# EasyEDA Pro project 606-Hihat-Generator.eprj

# Board PCB1
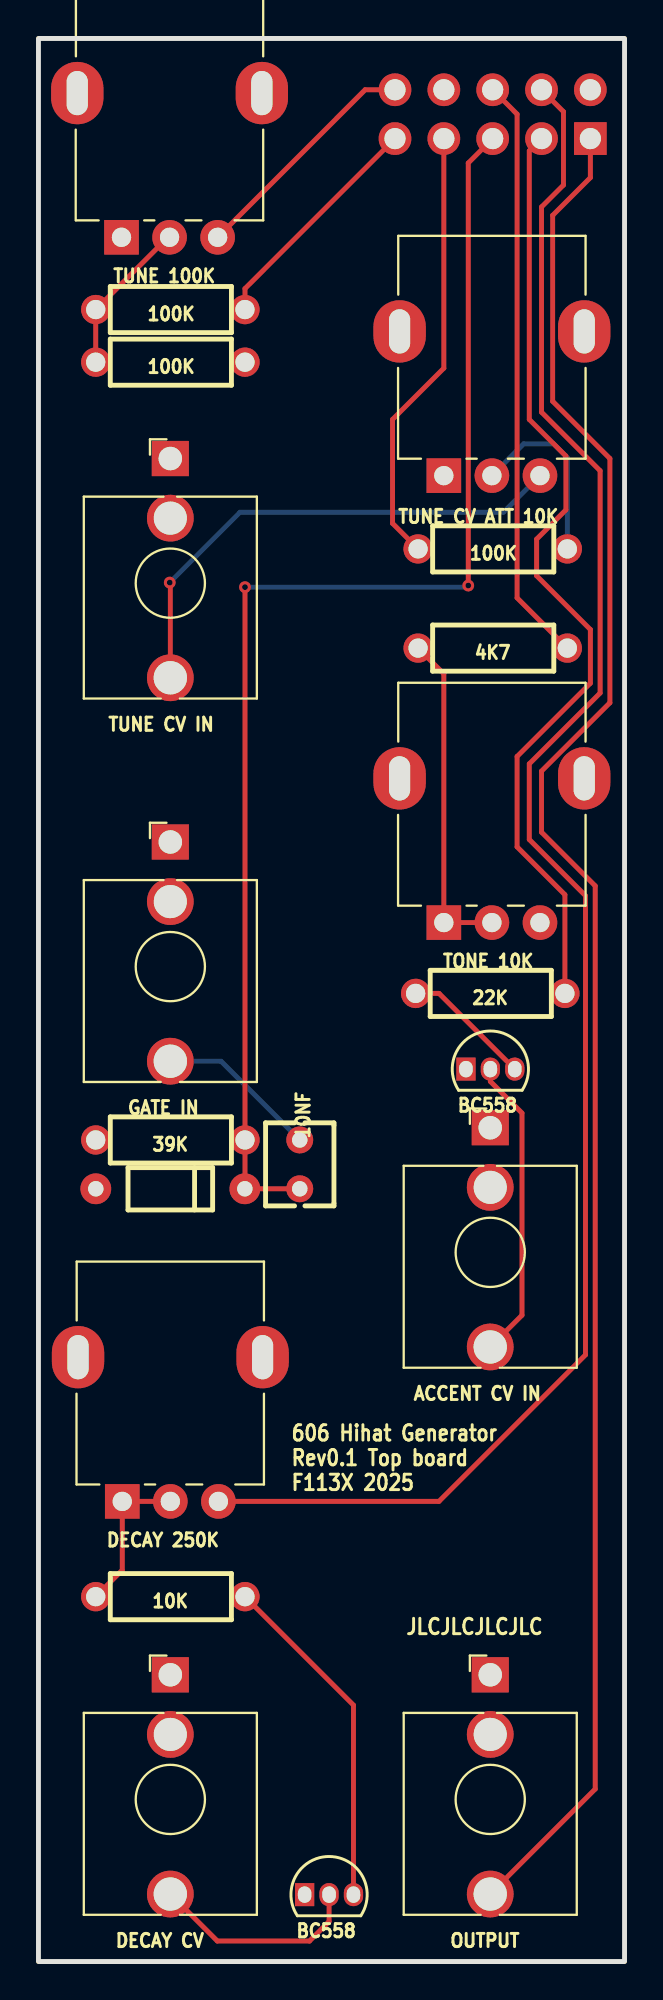
[diagram p0: board, top side]
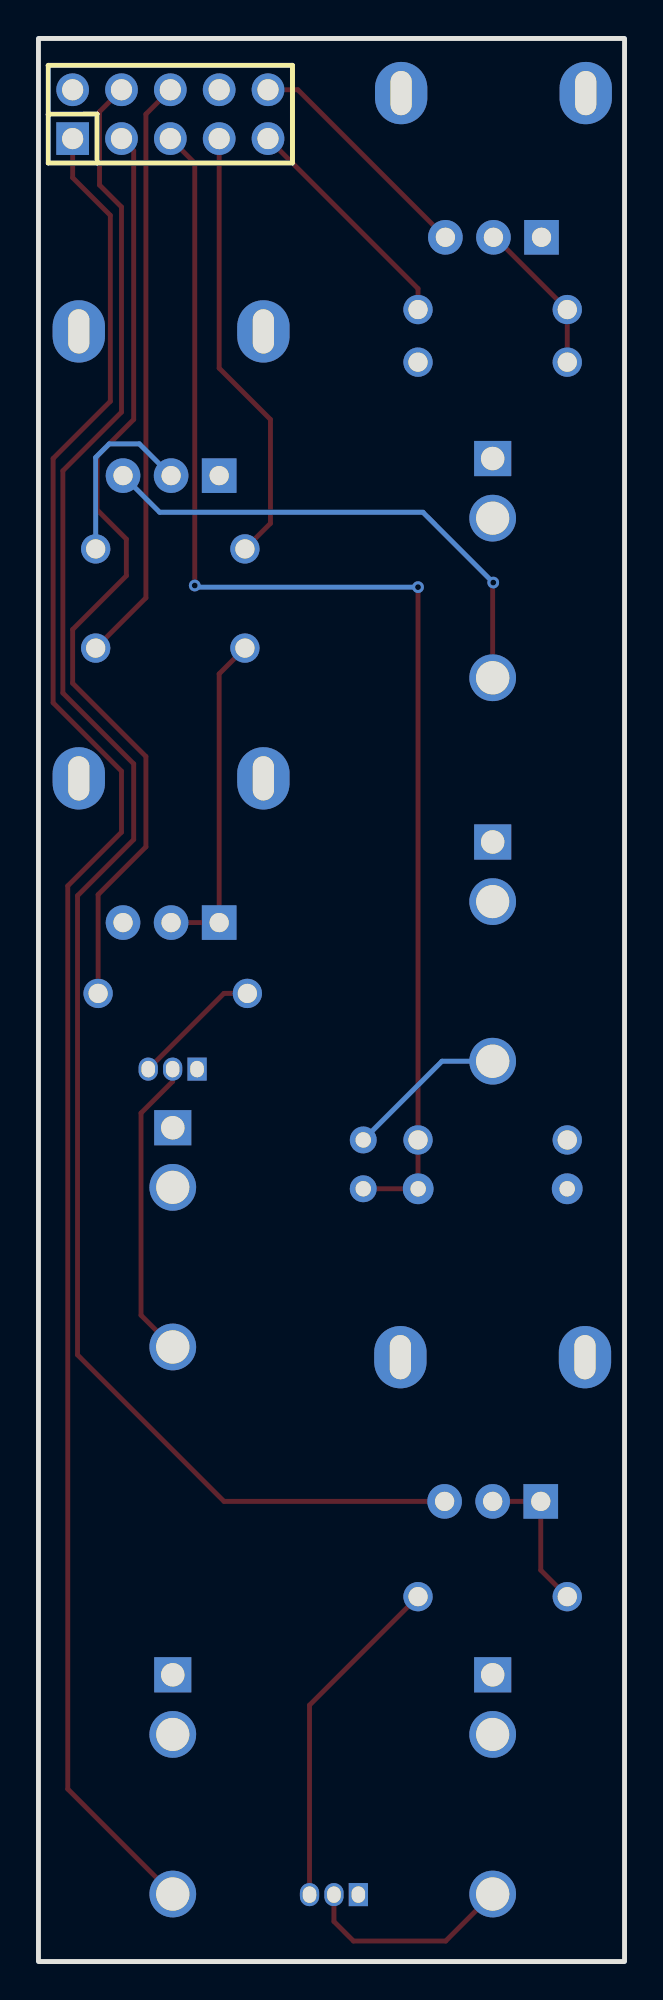
[diagram p1: board, bottom side, seen from below]

Outline 30.48 x 100 mm; copper layers: Top Layer, Bottom Layer. Coordinates in mm from the lower left corner of the outline.
Outline path: rectangle 0,100 30.48,0
Stack: Top Layer 0.035mm / Dielectric1 1.51mm FR4 er 4.5 / Bottom Layer 0.035mm

## Design rules (mm)
template: JLCPCB Capability(Two Layers Board)
spacing copperThickness1oz (default): track to track 0.102, other pairs 0.152 to 0.3
spacing copperThickness2oz: track to track 0.203, other pairs 0.152 to 0.3
track width copperThickness1oz (default): min 0.127, default 0.254, max 2.54
track width copperThickness2oz: min 0.203, default 0.254, max 2.54
differential pair differentialPair (default): width min 0.127, default 0.254, max 2.54; gap min 0.152, default 0.152
via viaSize (default): diameter min 0.5, default 0.61, max 10; hole min 0.3, default 0.305, max 6.3

## Placement (name value [footprint] x y rotation side)
4K7  -  [Resistor_Small]  23.62 68.3 0 top
10K  -  [Resistor_Small]  6.86 18.97 0 top
10NF  100nF  [CAP-TH_L4.2-W3.5-P2.54-D0.5]  13.59 41.45 270 top
22K  -  [Resistor_Small]  23.5 50.34 0 top
39K  -  [Resistor_Small]  6.86 42.72 0 top
100K  -  [Resistor_Small]  6.86 83.17 0 top
100K#2  -  [Resistor_Small]  6.86 85.9 0 top
100K#3  -  [Resistor_Small]  23.62 73.46 0 top
ACCENT CV IN  -  [benjiaomodular:AudioJack_3.5mm]  23.5 43.36 0 top
BC558  -  [TO-92-3_L4.5-W3.5-P1.27-L]  23.5 46.41 0 top
BC558#2  -  [TO-92-3_L4.5-W3.5-P1.27-L]  15.11 3.48 0 top
D1  1N4148  [DO-35_BD2.0-L4.2-P8.20-D0.5-RD]  6.86 40.18 180 top
DECAY 250K  -  [benjiaomodular:Potentiometer_RV09]  4.36 23.93 90 top
DECAY CV  -  [benjiaomodular:AudioJack_3.5mm]  6.86 14.91 0 top
GATE IN  -  [benjiaomodular:AudioJack_3.5mm]  6.86 58.22 0 top
OUTPUT  -  [benjiaomodular:AudioJack_3.5mm]  23.5 14.91 0 top
TONE 10K  -  [benjiaomodular:Potentiometer_RV09]  21.08 54.03 90 top
TUNE 100K  -  [benjiaomodular:Potentiometer_RV09]  4.32 89.66 90 top
TUNE CV ATT 10K  -  [benjiaomodular:Potentiometer_RV09]  21.08 77.27 90 top
TUNE CV IN  -  [benjiaomodular:AudioJack_3.5mm]  6.86 78.16 0 top
U1  ZX-PZ2.54-2-5PZZ  [HDR-TH_10P-P2.54-V-M-R2-C5-S2.54]  23.62 96.06 180 bottom

## Footprints (pads in the part's own frame, mm; a bottom-side part is the same pattern mirrored in y, then rotated)
benjiaomodular:AudioJack_3.5mm
  rect 1.93x1.83 hole 1.22: S(0,0)
  round 2.43 hole 1.73: T(0,-11.4)
  round 2.43 hole 1.72: TN(0,-3.1)
benjiaomodular:Potentiometer_RV09
  rect 1.8x1.8 hole 1: 1(0,0)
  round 1.8 hole 1: 2(0,-2.5) 3(0,-5)
  oval 3.24x2.72 hole 2.3x1.1: 4(7.5,-7.3) 5(7.5,2.3)
CAP-TH_L4.2-W3.5-P2.54-D0.5
  round 1.4 hole 0.8: 1(-1.27,0) 2(1.27,0)
DO-35_BD2.0-L4.2-P8.20-D0.5-RD
  round 1.6 hole 0.8: 1(-3.876,0) 2(3.876,0)
HDR-TH_10P-P2.54-V-M-R2-C5-S2.54
  rect 1.7x1.7 hole 1.1: 1(-5.08,-1.27)
  round 1.7 hole 1.1: 2(-5.08,1.27) 3(-2.54,-1.27) 4(-2.54,1.27) 5(0,-1.27) 6(0,1.27) 7(2.54,-1.27) 8(2.54,1.27) 9(5.08,-1.27) 10(5.08,1.27)
Resistor_Small
  round 1.524 hole 1: 1(-3.88,0) 2(3.882,0)
TO-92-3_L4.5-W3.5-P1.27-L
  rect 1x1.2 hole 0.7x0.85: 1(-1.27,0)
  oval 1x1.2 hole 0.7x0.85: 2(0,0) 3(1.27,0)

## Nets
GND: 39K.1 100K.2 ACCENT CV IN.S BC558.1 BC558#2.1 D1.2 DECAY CV.S GATE IN.S OUTPUT.S TONE 10K.3 TUNE 100K.1 TUNE CV ATT 10K.1 TUNE CV IN.S U1.2 U1.8
+12: TUNE 100K.3 U1.10
ACC-BACK: 22K.2 U1.3
ACC-RES: 22K.1 BC558.3
ACCENT CV: ACCENT CV IN.T BC558.2
CUTOFF FREQ: 4K7.1 TONE 10K.1 TONE 10K.2
CUTOFF-RES: 4K7.2 U1.6
CV IN: TUNE CV ATT 10K.3 TUNE CV IN.T
DECAY: DECAY 250K.3 U1.4
DECAY CV: BC558#2.2 DECAY CV.T
DECAY-MID: 10K.1 DECAY 250K.1 DECAY 250K.2
GATE IN: 10NF.1 GATE IN.T
GATE+: 10NF.2 39K.2 D1.1 U1.5
OUT: OUTPUT.T U1.1
PRE-DECAY-RES: 10K.2 BC558#2.3
TUNE CV MID: 100K#3.2 TUNE CV ATT 10K.2
TUNE MID: 100K.1 100K#2.1 TUNE 100K.2
TUNE+: 100K#2.2 U1.9
TUNE-: 100K#3.1 U1.7

Pads without a net: ACCENT CV IN TN; DECAY 250K 4 5; DECAY CV TN; GATE IN TN; OUTPUT TN; TONE 10K 4 5; TUNE 100K 4 5; TUNE CV ATT 10K 4 5; TUNE CV IN TN

## Via types
v1: diameter 0.61, hole 0.305, Top Layer to Bottom Layer, 3 vias

## Routing (per net, layer and track width the routed paths; a pad name or vN(x,y) marks a point on that pad's centre or on a via; arc(x,y) is an arc through that point)
+12: length 12.4
  Top Layer w0.254: 18.54,97.33 16.99,97.33 TUNE 100K.3
ACC-BACK: length 49.9
  Top Layer w0.254: U1.3 25.53,94.16 25.53,80.19 27.43,78.28 27.43,75.49 25.91,73.97 25.91,72.06 28.7,69.27 28.7,66.47 24.89,62.66 24.89,57.96 27.38,55.48 22K.2
ACC-RES: length 6.8
  Top Layer w0.254: BC558.3 20.83,50.34 22K.1
ACCENT CV: length 15.8
  Top Layer w0.254: BC558.2 23.5,45.76 25.15,44.12 25.15,33.61 ACCENT CV IN.T
CUTOFF FREQ: length 17.3
  Top Layer w0.254: TONE 10K.2 TONE 10K.1 21.08,66.96 4K7.1
CUTOFF-RES: length 30.6
  Top Layer w0.254: 23.62,97.33 24.89,96.06 24.89,70.91 4K7.2
CV IN: length 26.5
  Top Layer w0.254: TUNE CV IN.T 6.86,71.68 v1(6.83,71.71)
  Bottom Layer w0.254: v1(6.83,71.71) 10.48,75.36 24.18,75.36 TUNE CV ATT 10K.3
DECAY: length 93
  Top Layer w0.254: DECAY 250K.3 20.83,23.93 28.45,31.55 28.45,55.42 25.53,58.34 25.53,62.28 29.21,65.96 29.21,77.52 26.16,80.57 26.16,91.24 27.31,92.38 27.31,96.19 26.16,97.33
DECAY CV: length 11.1
  Top Layer w0.254: BC558#2.2 15.11,2.08 14.1,1.07 9.3,1.07 DECAY CV.T
DECAY-MID: length 8
  Top Layer w0.254: DECAY 250K.2 DECAY 250K.1 4.36,20.35 10K.1
GATE IN: length 8.4
  Bottom Layer w0.254: GATE IN.T 9.5,46.82 10NF.1
GATE+: length 69.6
  Top Layer w0.254: 10NF.2 D1.1 10.74,40.19 39K.2 v1(10.74,71.47) ; U1.5 22.35,93.52 v1(22.35,71.55)
  Bottom Layer w0.254: v1(22.35,71.55) 22.27,71.47 v1(10.74,71.47)
OUT: length 98.2
  Top Layer w0.254: U1.1 28.7,92.76 26.74,90.8 26.74,81.13 29.72,78.16 29.72,65.46 26.16,61.9 26.16,58.72 28.96,55.93 28.96,8.97 OUTPUT.T
PRE-DECAY-RES: length 17.8
  Top Layer w0.254: 10K.2 16.38,13.33 BC558#2.3
TUNE CV MID: length 9.7
  Bottom Layer w0.254: 100K#3.2 27.5,78.21 26.8,78.92 25.23,78.92 TUNE CV ATT 10K.2
TUNE MID: length 8.1
  Top Layer w0.254: 100K.1 100K#2.1 6.74,89.66 TUNE 100K.2
TUNE+: length 12.1
  Top Layer w0.254: 100K#2.2 10.74,86.99 U1.9
TUNE-: length 23
  Top Layer w0.254: 100K#3.1 18.41,74.78 18.41,80.19 21.08,82.86 U1.7

## Copper pours and planes (outline as drawn; the poured copper is in the pictures)
GND on Top Layer: 0,100 30.48,100 30.48,0 0,0
GND on Bottom Layer: 0,100 30.48,100 30.48,0 0,0

## Text on the board
Top Silkscreen Layer: 606 Hihat Generator / Rev0.1 Top board / F113X 2025 | JLCJLCJLCJLC

# Board PCB2
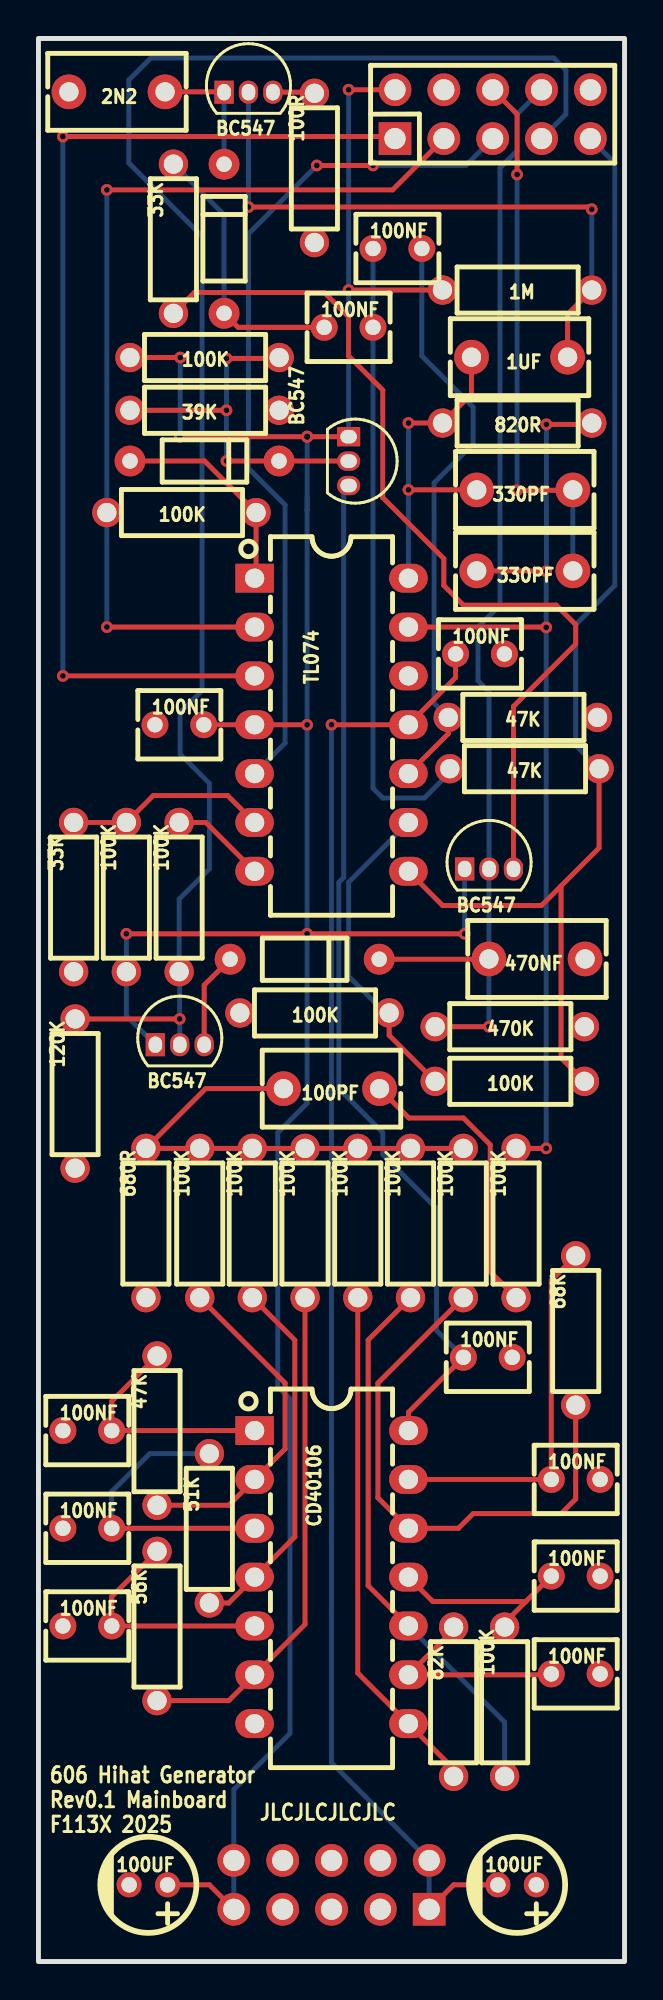
[diagram p2: board, top side]
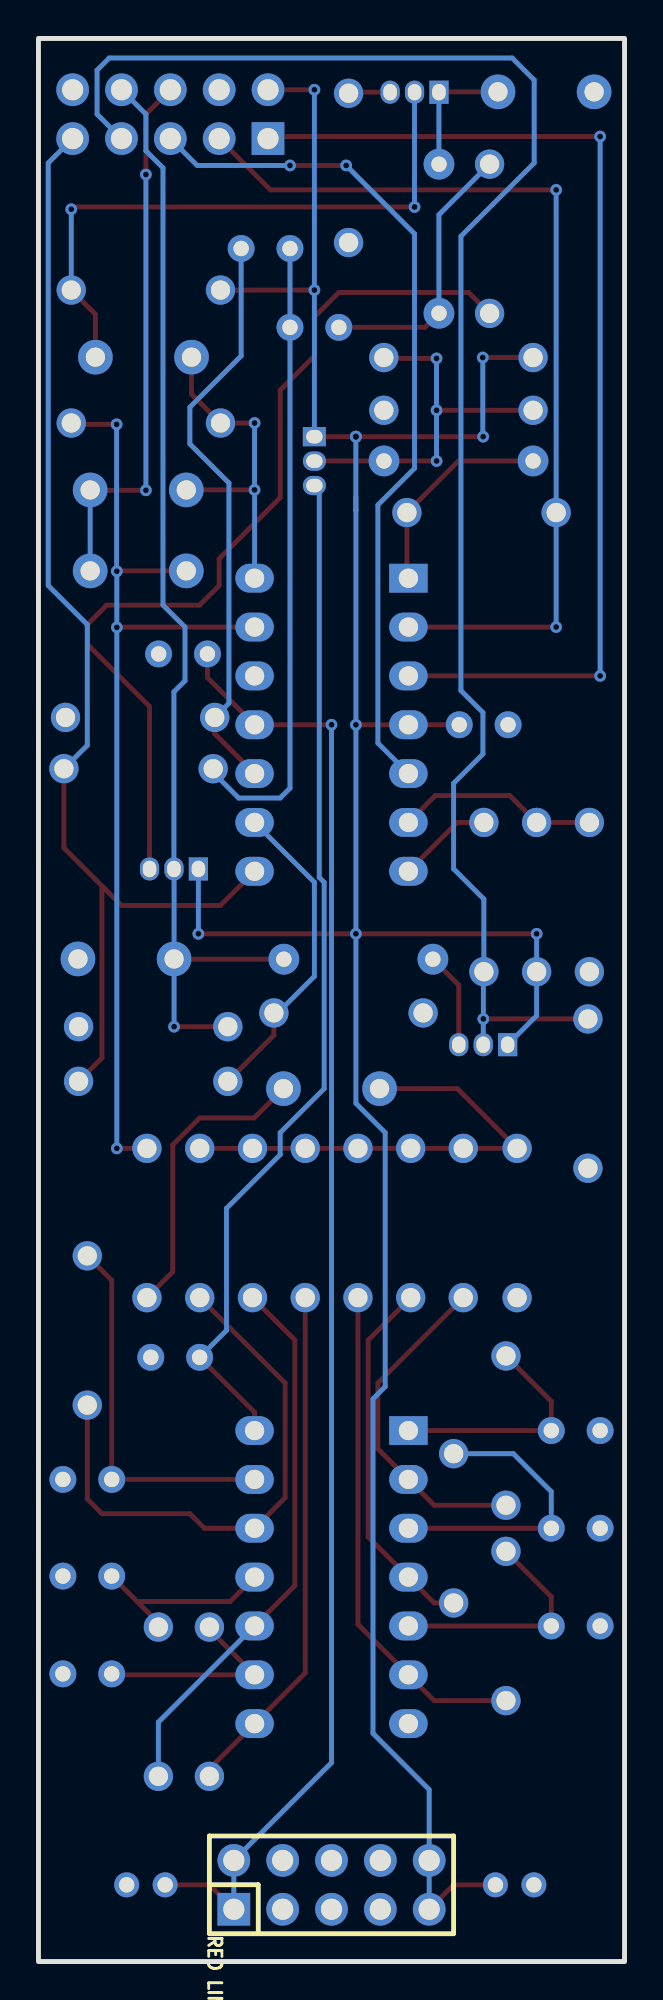
[diagram p3: board, bottom side, seen from below]

Outline 30.48 x 100 mm; copper layers: Top Layer, Bottom Layer. Coordinates in mm from the lower left corner of the outline.
Outline path: rectangle 0,100 30.48,0
Stack: Top Layer 0.035mm / Dielectric1 1.51mm FR4 er 4.5 / Bottom Layer 0.035mm

## Design rules (mm)
template: JLCPCB Capability(Two Layers Board)
spacing copperThickness1oz (default): track to track 0.102, other pairs 0.152 to 0.3
spacing copperThickness2oz: track to track 0.203, other pairs 0.152 to 0.3
track width copperThickness1oz (default): min 0.127, default 0.254, max 2.54
track width copperThickness2oz: min 0.203, default 0.254, max 2.54
differential pair differentialPair (default): width min 0.127, default 0.254, max 2.54; gap min 0.152, default 0.152
via viaSize (default): diameter min 0.5, default 0.61, max 10; hole min 0.3, default 0.305, max 6.3

## Placement (name value [footprint] x y rotation side)
1M  -  [Resistor_Small]  24.89 86.92 0 top
1UF  47nF  [CAP-TH_L7.2-W4.0-P5.00-D0.5]  25.02 83.43 0 top
2N2  47nF  [CAP-TH_L7.2-W4.0-P5.00-D0.5]  4.08 97.22 0 top
33K  -  [Resistor_Small]  7.02 89.59 270 top
33K#2  -  [Resistor_Small]  1.83 55.35 270 top
39K  -  [Resistor_Small]  8.64 80.67 0 top
47K  -  [Resistor_Small]  25.19 64.69 0 top
47K#2  -  [Resistor_Small]  25.27 62.03 0 top
47K#3  -  [Resistor_Small]  6.17 27.61 270 top
51K  -  [Resistor_Small]  8.89 22.53 270 top
56K  -  [Resistor_Small]  6.17 17.45 270 top
68K  -  [Resistor_Small]  27.94 32.82 270 top
82K  -  [Resistor_Small]  21.59 13.51 270 top
100K  -  [Resistor_Small]  14.35 49.33 0 top
100K#2  -  [Resistor_Small]  24.51 45.77 0 top
100K#3  -  [Resistor_Small]  7.44 75.35 0 top
100K#4  -  [Resistor_Small]  8.64 83.41 0 top
100K#5  -  [Resistor_Small]  8.39 38.41 270 top
100K#6  -  [Resistor_Small]  11.12 38.41 270 top
100K#7  -  [Resistor_Small]  13.86 38.41 270 top
100K#8  -  [Resistor_Small]  16.61 38.41 270 top
100K#9  -  [Resistor_Small]  19.35 38.41 270 top
100K#10  -  [Resistor_Small]  22.09 38.41 270 top
100K#11  -  [Resistor_Small]  24.24 13.51 270 top
100K#12  -  [Resistor_Small]  24.84 38.41 270 top
100K#13  -  [Resistor_Small]  4.57 55.35 270 top
100K#14  -  [Resistor_Small]  7.32 55.35 270 top
100NF  -  [CAP-TH_L4.2-W3.5-P2.54-D0.5]  16.13 84.98 0 top
100NF#2  -  [CAP-TH_L4.2-W3.5-P2.54-D0.5]  18.67 89.08 0 top
100NF#3  -  [CAP-TH_L4.2-W3.5-P2.54-D0.5]  23.37 31.42 0 top
100NF#4  -  [CAP-TH_L4.2-W3.5-P2.54-D0.5]  22.96 68 0 top
100NF#5  -  [CAP-TH_L4.2-W3.5-P2.54-D0.5]  7.33 64.31 0 top
100NF#6  -  [CAP-TH_L4.2-W3.5-P2.54-D0.5]  2.54 27.61 0 top
100NF#7  -  [CAP-TH_L4.2-W3.5-P2.54-D0.5]  2.54 22.53 0 top
100NF#8  -  [CAP-TH_L4.2-W3.5-P2.54-D0.5]  2.54 17.45 0 top
100NF#9  -  [CAP-TH_L4.2-W3.5-P2.54-D0.5]  27.94 25.07 0 top
100NF#10  -  [CAP-TH_L4.2-W3.5-P2.54-D0.5]  27.94 20.04 0 top
100NF#11  -  [CAP-TH_L4.2-W3.5-P2.54-D0.5]  27.94 14.96 0 top
100PF  47nF  [CAP-TH_L7.2-W4.0-P5.00-D0.5]  15.24 45.39 0 top
100R  -  [Resistor_Small]  14.35 93.27 270 top
100UF  -  [CAP-TH_BD5.0-P2.00-D0.8-FD]  24.89 3.99 180 top
100UF#2  -  [CAP-TH_BD5.0-P2.00-D0.8-FD]  5.72 3.99 180 top
120K  -  [Resistor_Small]  1.91 45.14 270 top
330PF  -  [CAP-TH_L7.2-W4.0-P5.00-D0.5]  25.29 76.52 0 top
330PF#2  -  [CAP-TH_L7.2-W4.0-P5.00-D0.5]  25.29 72.31 0 top
470K  -  [Resistor_Small]  24.51 48.61 0 top
470NF  47nF  [CAP-TH_L7.2-W4.0-P5.00-D0.5]  25.93 52.13 0 top
680R  -  [Resistor_Small]  5.59 38.41 270 top
820R  -  [Resistor_Small]  24.89 80 0 top
BC547  -  [TO-92-3_L4.5-W3.5-P1.27-L]  23.43 56.81 0 top
BC547#2  -  [TO-92-3_L4.5-W3.5-P1.27-L]  10.92 97.21 0 top
BC547#3  -  [TO-92-3_L4.5-W3.5-P1.27-L]  16.13 78.02 270 top
BC547#4  -  [TO-92-3_L4.5-W3.5-P1.27-L]  7.35 47.68 0 top
CD40106  TL074CN  [PDIP-14_L19.7-W6.6-P2.54-LS8.3-BL]  15.24 19.99 270 top
D1  -  [DO-35_BD2.0-L4.2-P8.20-D0.5-RD]  13.84 52.12 180 top
D1#2  -  [DO-35_BD2.0-L4.2-P8.20-D0.5-RD]  9.65 89.59 270 top
D1#3  -  [DO-35_BD2.0-L4.2-P8.20-D0.5-RD]  8.64 78.03 180 top
RED LINE  ZX-PZ2.54-2-5PZZ  [HDR-TH_10P-P2.54-V-M-R2-C5-S2.54]  15.24 3.99 180 bottom
TL074  TL074CN  [PDIP-14_L19.7-W6.6-P2.54-LS8.3-BL]  15.24 64.31 270 top
U1  ZX-PZ2.54-2-5PZZ  [HDR-TH_10P-P2.54-V-M-R2-C5-S2.54]  23.62 96.06 0 top

## Footprints (pads in the part's own frame, mm; a bottom-side part is the same pattern mirrored in y, then rotated)
CAP-TH_BD5.0-P2.00-D0.8-FD
  round 1.3 hole 0.8: 1(-1,0) 2(1,0)
CAP-TH_L4.2-W3.5-P2.54-D0.5
  round 1.4 hole 0.8: 1(-1.27,0) 2(1.27,0)
CAP-TH_L7.2-W4.0-P5.00-D0.5
  round 1.8 hole 1: 1(-2.499,0) 2(2.499,0)
DO-35_BD2.0-L4.2-P8.20-D0.5-RD
  round 1.6 hole 0.8: 1(-3.876,0) 2(3.876,0)
HDR-TH_10P-P2.54-V-M-R2-C5-S2.54
  rect 1.7x1.7 hole 1.1: 1(-5.08,-1.27)
  round 1.7 hole 1.1: 2(-5.08,1.27) 3(-2.54,-1.27) 4(-2.54,1.27) 5(0,-1.27) 6(0,1.27) 7(2.54,-1.27) 8(2.54,1.27) 9(5.08,-1.27) 10(5.08,1.27)
PDIP-14_L19.7-W6.6-P2.54-LS8.3-BL
  rect 1.5x2 hole 1: 1(-7.62,-4)
  oval 1.5x2 hole 1: 2(-5.08,-4) 3(-2.54,-4) 4(0,-4) 5(2.54,-4) 6(5.08,-4) 7(7.62,-4) 8(7.62,4) 9(5.08,4) 10(2.54,4) 11(0,4) 12(-2.54,4) 13(-5.08,4) 14(-7.62,4)
Resistor_Small
  round 1.524 hole 1: 1(-3.88,0) 2(3.882,0)
TO-92-3_L4.5-W3.5-P1.27-L
  rect 1x1.2 hole 0.7x0.85: 1(-1.27,0)
  oval 1x1.2 hole 0.7x0.85: 2(0,0) 3(1.27,0)

## Nets
40106VDD: 100NF#3.1 BC547#3.3 CD40106.14
GND: 2N2.1 33K#2.2 39K.2 47K.2 100K.1 100NF#3.2 100NF#4.2 100NF#5.1 100NF#6.1 100NF#7.1 100NF#8.1 100NF#9.2 100NF#10.2 100NF#11.2 100R.2 100UF.1 100UF#2.2 120K.2 470K.2 470NF.2 680R.2 CD40106.7 RED LINE.3 RED LINE.4 RED LINE.5 RED LINE.6 RED LINE.7 RED LINE.8 TL074.12 U1.4 U1.10
33K: 33K.2 BC547.3
+: 47K.1 100NF#2.2 TL074.10
+12: 1M.1 100K#4.1 100K#13.2 100NF#5.2 100UF#2.1 BC547.1 BC547#3.1 BC547#4.1 RED LINE.9 RED LINE.10 TL074.4 U1.2
-12: 100NF#4.1 100UF.2 RED LINE.1 RED LINE.2 TL074.11
ACC-BACK: 100K#14.2 120K.1 BC547#4.2 U1.7
CUTOFF-RES: 330PF.2 330PF#2.2 U1.6
DECAY: 470K.1 470NF.1 BC547.2 D1.1 U1.8
GATE+: TL074.5 U1.5
IN1: 47K#3.1 100NF#6.2 CD40106.1
IN2: 51K.1 100NF#7.2 CD40106.3
IN3: 56K.1 100NF#8.2 CD40106.5
IN4: 68K.1 100NF#9.1 CD40106.13
IN5: 100K#11.1 100NF#10.1 CD40106.11
IN6: 82K.1 100NF#11.1 CD40106.9
OUT1: 47K#3.2 100K#5.2 CD40106.2
OUT2: 51K.2 100K#6.2 CD40106.4
OUT3: 56K.2 100K#7.2 CD40106.6
OUT4: 68K.2 100K#10.2 CD40106.12
OUT5: 100K#9.2 100K#11.2 CD40106.10
OUT6: 82K.2 100K#8.2 CD40106.8
OUTPUT: 47K#2.2 100K#2.2 TL074.8 U1.9
TUNE+: TL074.3 U1.1
TUNE-: 100K#3.1 TL074.2 U1.3
VCA-IN: 1M.2 1UF.2 BC547#2.2

Pads without a net: 1UF 1; 2N2 2; 33K 1; 33K#2 1; 39K 1; 47K#2 1; 100K 2; 100K#2 1; 100K#3 2; 100K#4 2; 100K#5 1; 100K#6 1; 100K#7 1; 100K#8 1; 100K#9 1; 100K#10 1; 100K#12 1 2; 100K#13 1; 100K#14 1; 100NF 1 2; 100NF#2 1; 100PF 1 2; 100R 1; 330PF 1; 330PF#2 1; 680R 1; 820R 1 2; BC547#2 1 3; BC547#3 2; BC547#4 3; D1 2; D1#2 1 2; D1#3 1 2; TL074 1 6 7 9 13 14

## Via types
v1: diameter 0.61, hole 0.305, Top Layer to Bottom Layer, 33 vias

## Routing (per net, layer and track width the routed paths; a pad name or vN(x,y) marks a point on that pad's centre or on a via; arc(x,y) is an arc through that point)
40106VDD: length 53.2
  Top Layer w0.254: 100NF#3.1 19.24,28.56 CD40106.14
  Bottom Layer w0.254: 100NF#3.1 20.7,32.82 20.7,39.17 17.91,41.96 17.91,43.1 15.62,45.39 15.62,56.12 15.88,56.37 15.88,76.5 BC547#3.3
(no net): length 234.5
  Top Layer w0.254: v1(26.4,72.3) 26.39,72.31 330PF#2.1 ; D1#2.2 10.38,84.98 14.86,84.98 ; 39K.1 v1(9.78,80.67) ; D1#3.2 8.64,78.03 100K#3.2 11.32,72.01 TL074.1 ; 1UF.1 22.52,81.51 820R.1 v1(19.24,80) ; BC547#2.1 9.63,97.22 2N2.2 ; 100K#14.1 8.7,59.23 TL074.7 ; 100PF.1 8.69,45.39 680R.1 100K#5.1 100K#6.1 100K#7.1 100K#8.1 100K#9.1 100K#10.1 ; BC547#2.3 14.3,97.21 100R.1 ; BC547#4.3 8.62,50.77 9.97,52.12 ; 100PF.2 19.26,43.87 22.1,43.87 23.5,42.47 23.5,35.87 100K#12.2 ; 100K#12.1 v1(26.4,42.28) ; 100K.2 18.24,48.17 100K#2.1 ; v1(9.78,78.03) D1#3.1 16.12,78.03 BC547#3.2 ; TL074.13 26.39,69.39 v1(26.4,69.38) ; v1(19.24,76.53) 22.79,76.53 330PF.1 ; 100K#4.2 12.47,83.36 v1(9.78,83.36) ; TL074.6 9.84,60.63 5.97,60.63 100K#13.1 33K#2.1 ; 820R.2 28.71,79.93 v1(26.42,79.93)
  Bottom Layer w0.254: TL074.14 19.24,76.53 ; v1(26.42,79.93) 26.42,72.31 v1(26.4,72.3) v1(26.4,69.38) v1(26.4,42.28) ; D1#2.2 9.65,90.83 7.02,93.47 ; D1#2.1 BC547#2.1 ; 100NF#2.1 100NF.2 17.4,61.01 17.91,60.5 20.07,60.5 21.39,61.83 47K#2.1 ; v1(19.24,76.53) v1(19.24,80) ; 100K.2 18.03,49.33 16.13,51.23 16.13,56.12 TL074.9 ; v1(9.78,83.36) 9.78,80.67 v1(9.78,80.67) v1(9.78,78.03)
33K: length 47.9
  Top Layer w0.254: BC547.3 24.7,65.27 27.94,68.5 27.94,69.52 26.92,70.54 22.1,70.54 21.08,71.55 21.08,72.95 17.91,76.12 17.91,81.71 16.13,83.49 16.13,85.52 14.86,86.79 8.11,86.79 33K.2
+: length 30.4
  Top Layer w0.254: 47K.1 21.31,63.84 TL074.10
  Bottom Layer w0.254: 47K.1 20.57,65.43 20.57,76.89 22.61,78.92 22.61,80.82 19.94,83.49 100NF#2.2
+12: length 156.9
  Top Layer w0.254: BC547#3.1 v1(13.97,79.29) v1(7.35,79.29) ; 100K#4.1 v1(7.37,83.41) ; v1(4.57,53.44) v1(13.97,53.44) v1(22.16,53.44) ; v1(16.13,97.33) 18.54,97.33 ; RED LINE.9 8.89,3.99 100UF#2.1 ; v1(13.97,64.31) 13.97,64.31 TL074.4 100NF#5.2 ; v1(16.13,86.92) 1M.1
  Bottom Layer w0.254: RED LINE.9 RED LINE.10 10.16,8.94 13.08,11.86 13.08,29.26 12.45,29.9 12.45,43.1 13.97,44.63 v1(13.97,53.44) v1(13.97,64.31) 13.97,75.47 ; 13.97,75.47 13.97,75.47 13.97,76.12 ; 13.97,75.47 13.97,76.12 ; 6.08,47.68 4.57,49.18 100K#13.2 v1(4.57,53.44) ; v1(22.16,53.44) BC547.1 ; v1(13.97,79.29) 13.97,76.12 ; v1(7.35,79.29) 7.37,79.31 v1(7.37,83.41) ; BC547#3.1 v1(16.13,86.92) v1(16.13,97.33)
-12: length 76.5
  Top Layer w0.254: RED LINE.1 21.59,3.99 100UF.2 ; 100NF#4.1 21.69,66.77 TL074.11 v1(15.24,64.31)
  Bottom Layer w0.254: v1(15.24,64.31) 15.24,10.34 RED LINE.2 RED LINE.1
ACC-BACK: length 86.5
  Top Layer w0.254: 120K.1 v1(7.34,49.02)
  Bottom Layer w0.254: BC547#4.2 7.35,49.01 v1(7.34,49.02) 7.34,51.44 100K#14.2 7.32,55.25 8.89,56.82 8.89,61.27 7.37,62.79 7.37,64.95 8.51,66.09 8.51,89.71 4.7,93.52 4.7,97.84 5.84,98.98 26.8,98.98 27.43,98.35 27.43,96.06 U1.7
CUTOFF-RES: length 28.5
  Top Layer w0.254: v1(24.89,76.5) 27.77,76.5 330PF.2 ; 23.62,97.33 24.89,96.06 v1(24.89,92.93)
  Bottom Layer w0.254: v1(24.89,76.5) v1(24.89,92.93) ; 330PF#2.2 330PF.2
DECAY: length 58.8
  Top Layer w0.254: 470NF.1 23.41,52.12 D1.1 ; 470K.1 v1(23.43,48.61)
  Bottom Layer w0.254: v1(23.43,48.61) 470NF.1 23.43,56.81 BC547.2 23.43,66.03 22.86,66.6 22.86,69.39 24,70.54 24,93.27 24.89,94.16 24.89,96.06 26.16,97.33
GATE+: length 44.3
  Top Layer w0.254: v1(14.48,93.4) v1(17.4,93.4)
  Bottom Layer w0.254: v1(14.48,93.4) 10.92,89.84 10.92,77.65 12.83,75.74 12.83,63.36 TL074.5 ; U1.5 22.22,93.4 v1(17.4,93.4)
IN1: length 12.3
  Top Layer w0.254: CD40106.1 100NF#6.2 3.81,29.13 47K#3.1
IN2: length 15.2
  Top Layer w0.254: 100NF#7.2 CD40106.3
  Bottom Layer w0.254: 100NF#7.2 3.81,24.44 5.78,26.41 51K.1
IN3: length 12.3
  Top Layer w0.254: CD40106.5 100NF#8.2 3.81,18.97 56K.1
IN4: length 19.6
  Top Layer w0.254: CD40106.13 100NF#9.1 26.67,35.43 68K.1
IN5: length 10.3
  Top Layer w0.254: CD40106.11 20.51,18.72 25.35,18.72 ; 100K#11.1 24.24,17.62 25.35,18.72 ; 25.35,18.72 100NF#10.1
IN6: length 10.9
  Top Layer w0.254: 82K.1 21.59,17.26 CD40106.9 26.62,14.91 100NF#11.1
OUT1: length 17.6
  Top Layer w0.254: 100K#5.2 12.83,30.08 12.83,26.66 CD40106.2 9.9,23.73 47K#3.2
OUT2: length 19.2
  Top Layer w0.254: 100K#6.2 13.34,32.31 13.34,22.09 CD40106.4 9.9,18.65 51K.2
OUT3: length 26.3
  Top Layer w0.254: 56K.2 9.9,13.57 CD40106.6 13.86,17.53 100K#7.2
OUT4: length 28.7
  Top Layer w0.254: 68K.2 27.94,24.05 27.18,23.29 22.61,23.29 21.84,22.53 CD40106.12 17.65,24.12 17.65,30.08 100K#10.2
OUT5: length 28.7
  Top Layer w0.254: CD40106.10 17.15,19.54 17.15,32.32 100K#9.2
  Bottom Layer w0.254: CD40106.10 24.24,12.45 100K#11.2
OUT6: length 27
  Top Layer w0.254: 100K#8.2 16.61,15 CD40106.8 21.59,10.02 82K.2
OUTPUT: length 61.3
  Top Layer w0.254: 47K#2.2 29.16,57.91 27.18,55.93 ; 27.18,55.93 27.18,46.99 100K#2.2 ; 27.18,55.93 26.16,54.92 21.02,54.92 TL074.8
  Bottom Layer w0.254: 47K#2.2 27.94,63.24 27.94,69.52 29.97,71.55 29.97,93.52 U1.9
TUNE+: length 55.3
  Top Layer w0.254: 11.24,66.85 v1(1.27,66.85) ; U1.1 18.44,94.9 v1(1.27,94.9)
  Bottom Layer w0.254: v1(1.27,66.85) v1(1.27,94.9)
TUNE-: length 49
  Top Layer w0.254: v1(3.56,92.13) 18.41,92.13 U1.3 ; v1(3.56,69.39) TL074.2
  Bottom Layer w0.254: v1(3.56,92.13) 3.56,69.4 v1(3.56,69.39)
VCA-IN: length 32.1
  Top Layer w0.254: v1(28.77,91.12) 28.66,91.24 v1(10.92,91.24) ; 1M.2 27.52,85.66 1UF.2
  Bottom Layer w0.254: v1(10.92,91.24) BC547#2.2 ; 1M.2 v1(28.77,91.12)

## Copper pours and planes (outline as drawn; the poured copper is in the pictures)
GND on Top Layer: 0,100 30.48,100 30.48,0 0,0
GND on Bottom Layer: 0,100 30.48,100 30.48,0 0,0

## Text on the board
Top Silkscreen Layer: 606 Hihat Generator / Rev0.1 Mainboard / F113X 2025 | JLCJLCJLCJLC

# Board PCB3
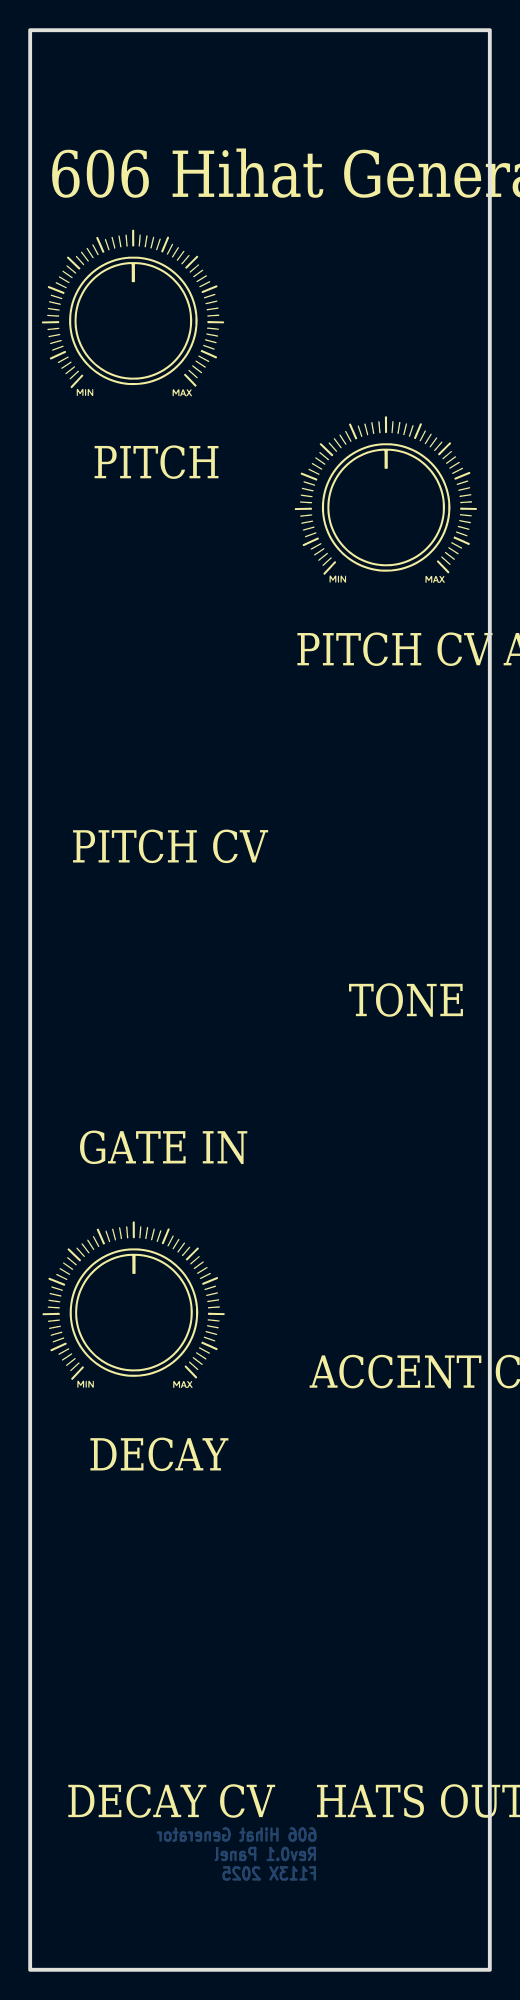
[diagram p4: board, top side]
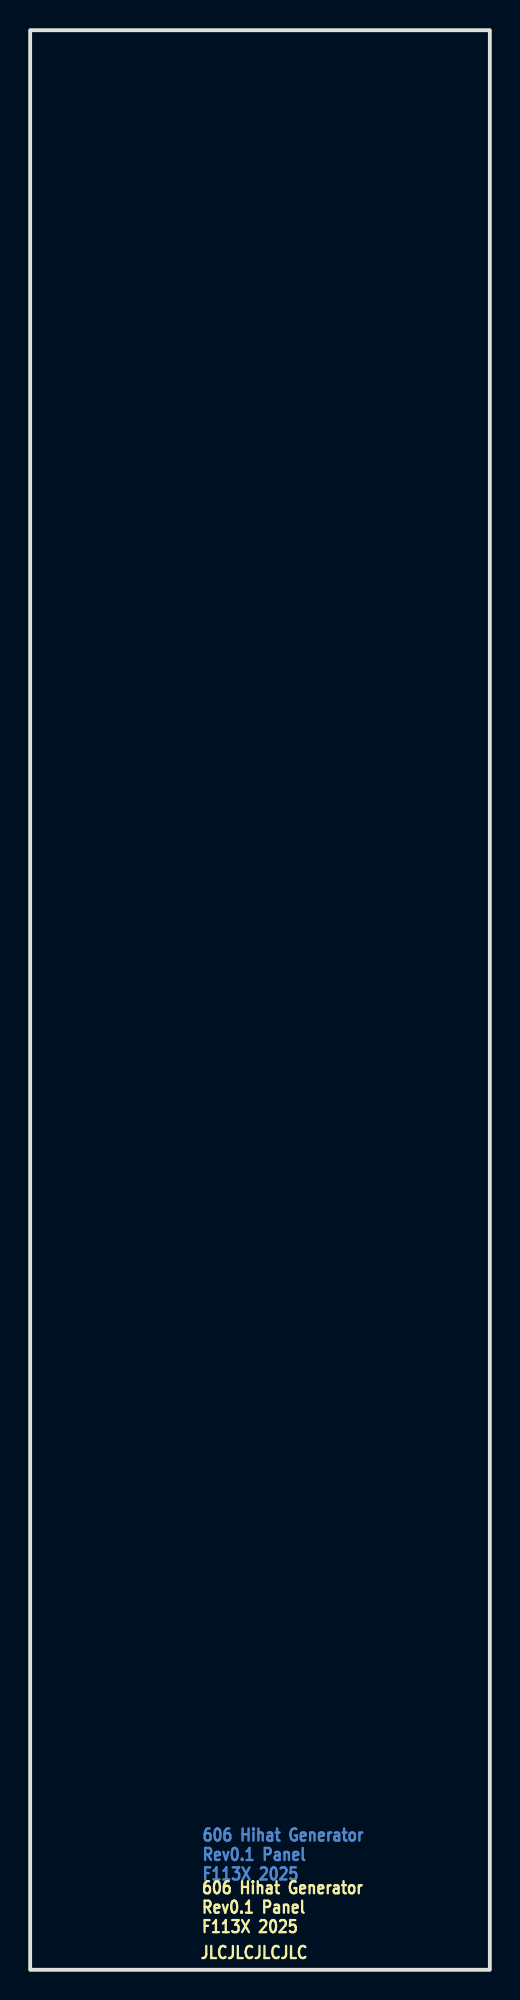
[diagram p5: board, bottom side, seen from below]

Outline 30.48 x 128.5 mm; copper layers: Top Layer, Bottom Layer. Coordinates in mm from the lower left corner of the outline.
Outline path: rectangle 0,128.5 30.48,0
Stack: Top Layer 0.035mm / Dielectric1 1.51mm FR4 er 4.5 / Bottom Layer 0.035mm

## Design rules (mm)
template: JLCPCB Capability(Two Layers Board)
spacing copperThickness1oz (default): track to track 0.102, other pairs 0.152 to 0.3
spacing copperThickness2oz: track to track 0.203, other pairs 0.152 to 0.3
track width copperThickness1oz (default): min 0.127, default 0.254, max 2.54
track width copperThickness2oz: min 0.203, default 0.254, max 2.54
differential pair differentialPair (default): width min 0.127, default 0.254, max 2.54; gap min 0.152, default 0.152
via viaSize (default): diameter min 0.5, default 0.61, max 10; hole min 0.3, default 0.305, max 6.3

## Placement (name value [footprint] x y rotation side)

## Nets

## Text on the board
Bottom Layer: 606 Hihat Generator / Rev0.1 Panel / F113X 2025
Bottom Silkscreen Layer: 606 Hihat Generator / Rev0.1 Panel / F113X 2025 | JLCJLCJLCJLC
Top Silkscreen Layer: DECAY CV | PITCH CV | GATE IN | DECAY | PITCH | PITCH CV ATT | ACCENT CV | HATS OUT | TONE | 606 Hihat Generator
